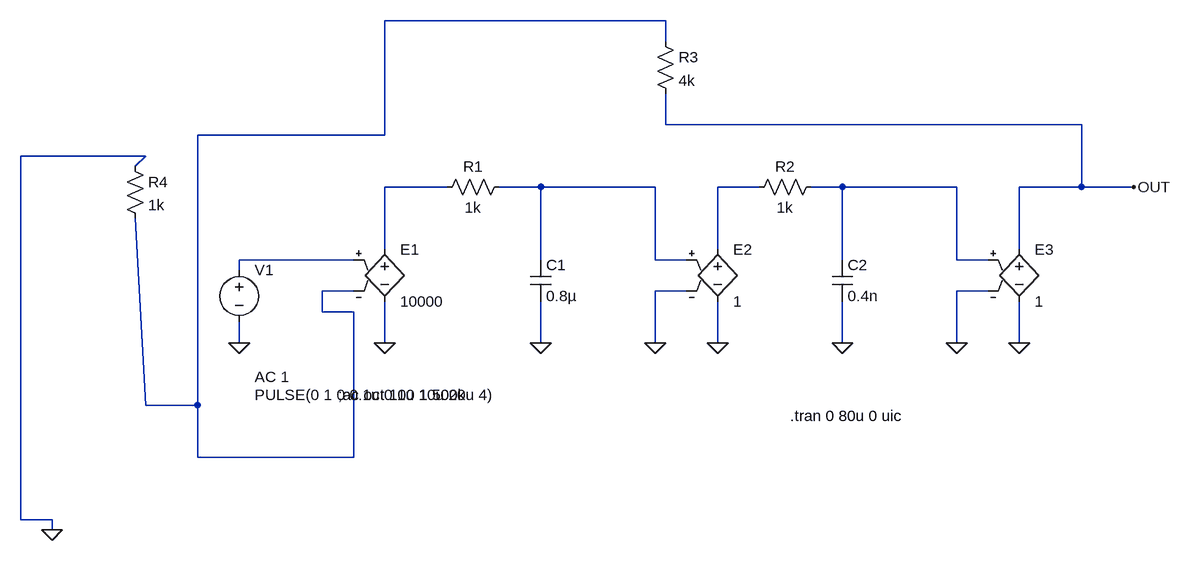
[diagram p0: schematic op-amp-1.asc]
op-amp-1.asc, the LTspice schematic file:
Version 4
SHEET 1 1236 680
WIRE 448 -224 16 -224
WIRE 448 -192 448 -224
WIRE 448 -64 448 -112
WIRE 1088 -64 448 -64
WIRE 16 -48 16 -224
WIRE 16 -48 -272 -48
WIRE -352 -16 -544 -16
WIRE -368 0 -352 -16
WIRE 112 32 16 32
WIRE 256 32 192 32
WIRE 432 32 256 32
WIRE 592 32 528 32
WIRE 720 32 672 32
WIRE 896 32 720 32
WIRE 1088 32 1088 -64
WIRE 1088 32 992 32
WIRE 1168 32 1088 32
WIRE 16 128 16 32
WIRE 528 128 528 32
WIRE 992 128 992 32
WIRE -32 144 -208 144
WIRE 256 144 256 32
WIRE 432 144 432 32
WIRE 480 144 432 144
WIRE 720 144 720 32
WIRE 896 144 896 32
WIRE 944 144 896 144
WIRE -208 160 -208 144
WIRE -32 192 -80 192
WIRE 480 192 432 192
WIRE 944 192 896 192
WIRE -80 224 -80 192
WIRE -32 224 -80 224
WIRE -208 272 -208 240
WIRE 16 272 16 208
WIRE 256 272 256 208
WIRE 432 272 432 192
WIRE 528 272 528 208
WIRE 720 272 720 208
WIRE 896 272 896 192
WIRE 992 272 992 208
WIRE -352 368 -368 80
WIRE -272 368 -272 -48
WIRE -272 368 -352 368
WIRE -272 448 -272 368
WIRE -32 448 -32 224
WIRE -32 448 -272 448
WIRE -544 544 -544 -16
WIRE -496 544 -544 544
WIRE -496 560 -496 544
FLAG 16 272 0
FLAG 256 272 0
FLAG 528 272 0
FLAG 720 272 0
FLAG 992 272 0
FLAG 896 272 0
FLAG 432 272 0
FLAG 1168 32 OUT
FLAG -208 272 0
FLAG -496 560 0
SYMBOL voltage -208 144 R0
WINDOW 3 24 208 Left 2
WINDOW 123 24 180 Left 2
WINDOW 39 0 0 Left 0
SYMATTR Value PULSE(0 1 0 0.1u 0.1u 10u 20u 4)
SYMATTR Value2 AC 1
SYMATTR InstName V1
SYMBOL e 16 112 R0
SYMATTR InstName E1
SYMATTR Value 10000
SYMBOL res 208 16 R90
WINDOW 0 0 56 VBottom 2
WINDOW 3 32 56 VTop 2
SYMATTR InstName R1
SYMATTR Value 1k
SYMBOL cap 240 144 R0
SYMATTR InstName C1
SYMATTR Value 0.8µ
SYMBOL e 528 112 R0
SYMATTR InstName E2
SYMATTR Value 1
SYMBOL e 992 112 R0
SYMATTR InstName E3
SYMATTR Value 1
SYMBOL cap 704 144 R0
SYMATTR InstName C2
SYMATTR Value 0.4n
SYMBOL res 688 16 R90
WINDOW 0 0 56 VBottom 2
WINDOW 3 32 56 VTop 2
SYMATTR InstName R2
SYMATTR Value 1k
SYMBOL res 432 -208 R0
SYMATTR InstName R3
SYMATTR Value 4k
SYMBOL res -384 -16 R0
SYMATTR InstName R4
SYMATTR Value 1k
TEXT -56 352 Left 2 !;ac oct 100 1 500k
TEXT 640 384 Left 2 !.tran 0 80u 0 uic

The netlist it stands for:
* op-amp-1.asc
V1 N006 0 PULSE(0 1 0 0.1u 0.1u 10u 20u 4) AC 1
E1 N002 0 N006 N001 10000
R1 N003 N002 1k
C1 N003 0 0.8µ
E2 N004 0 N003 0 1
E3 OUT 0 N005 0 1
C2 N005 0 0.4n
R2 N005 N004 1k
R3 N001 OUT 4k
R4 0 N001 1k
;ac oct 100 1 500k
.tran 0 80u 0 uic
.backanno
.end